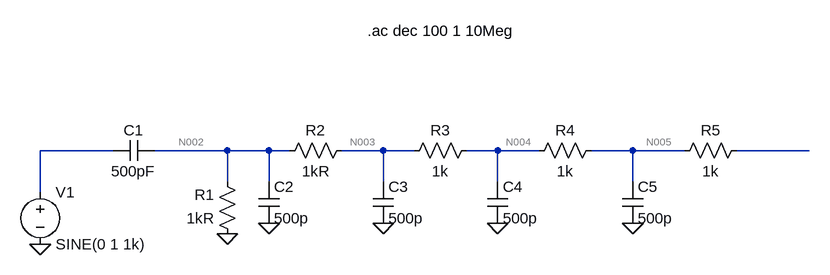
[diagram p0: schematic HPS1_LSP4.asc]
HPS1_LSP4.asc, the LTspice schematic file:
Version 4
SHEET 1 1268 680
WIRE 192 272 80 272
WIRE 368 272 256 272
WIRE 432 272 368 272
WIRE 464 272 432 272
WIRE 608 272 544 272
WIRE 656 272 608 272
WIRE 784 272 736 272
WIRE 848 272 784 272
WIRE 992 272 928 272
WIRE 1072 272 992 272
WIRE 1264 272 1152 272
WIRE 368 320 368 272
WIRE 432 320 432 272
WIRE 608 320 608 272
WIRE 784 320 784 272
WIRE 992 320 992 272
WIRE 80 336 80 272
FLAG 368 400 0
FLAG 80 416 0
FLAG 432 384 0
FLAG 608 384 0
FLAG 784 384 0
FLAG 992 384 0
SYMBOL Res 384 416 R180
WINDOW 0 36 76 Left 2
WINDOW 3 36 40 Left 2
SYMATTR InstName R1
SYMATTR Value 1kR
SYMBOL Cap 256 256 R90
WINDOW 0 0 32 VBottom 2
WINDOW 3 32 32 VTop 2
SYMATTR InstName C1
SYMATTR Value 500pF
SYMBOL voltage 80 320 R0
SYMATTR InstName V1
SYMATTR Value SINE(0 1 1k)
SYMATTR Value2 AC 1 0
SYMBOL Res 560 256 R90
WINDOW 0 0 56 VBottom 2
WINDOW 3 32 56 VTop 2
SYMATTR InstName R2
SYMATTR Value 1kR
SYMBOL Res 752 256 R90
WINDOW 0 0 56 VBottom 2
WINDOW 3 32 56 VTop 2
SYMATTR InstName R3
SYMATTR Value 1k
SYMBOL Res 944 256 R90
WINDOW 0 0 56 VBottom 2
WINDOW 3 32 56 VTop 2
SYMATTR InstName R4
SYMATTR Value 1k
SYMBOL Res 1168 256 R90
WINDOW 0 0 56 VBottom 2
WINDOW 3 32 56 VTop 2
SYMATTR InstName R5
SYMATTR Value 1k
SYMBOL Cap 416 320 R0
SYMATTR InstName C2
SYMATTR Value 500p
SYMBOL Cap 592 320 R0
SYMATTR InstName C3
SYMATTR Value 500p
SYMBOL Cap 768 320 R0
SYMATTR InstName C4
SYMATTR Value 500p
SYMBOL Cap 976 320 R0
SYMATTR InstName C5
SYMATTR Value 500p
TEXT 584 88 Left 2 !.ac dec 100 1 10Meg

The netlist it stands for:
* HPS1_LSP4.asc
R1 0 N002 1kR
C1 N002 N001 500pF
V1 N001 0 SINE(0 1 1k) AC 1 0
R2 N003 N002 1kR
R3 N004 N003 1k
R4 N005 N004 1k
R5 N006 N005 1k
C2 N002 0 500p
C3 N003 0 500p
C4 N004 0 500p
C5 N005 0 500p
.ac dec 100 1 10Meg
.backanno
.end

* Results of the author's LTspice run, read from the files saved beside the schematic
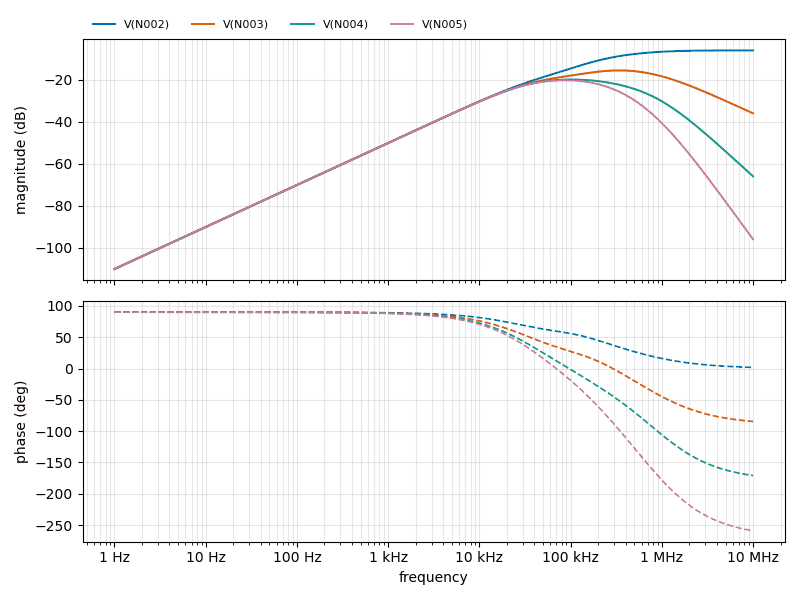
[diagram p1: AC Analysis of HPS1_LSP4.asc, plotted from the saved traces]
* AC Analysis, 1 run:
*   V(N002): -110.06 dB at 1 Hz, -6.03 dB at 10 MHz, peak -6.03 dB at 10 MHz, 3 dB below the peak at 313.7 kHz
*   V(N003): -110.06 dB at 1 Hz, -36.00 dB at 10 MHz, peak -15.56 dB at 338.8 kHz, 3 dB below the peak at 82.63 kHz and 1.037 MHz
*   V(N004): -110.06 dB at 1 Hz, -65.97 dB at 10 MHz, peak -19.91 dB at 102.3 kHz, 3 dB below the peak at 29.44 kHz and 382.7 kHz
*   V(N005): -110.06 dB at 1 Hz, -95.92 dB at 10 MHz, peak -20.26 dB at 85.11 kHz, 3 dB below the peak at 27.7 kHz and 247.1 kHz